# EAGLE design microcontroller_r1 (EAGLE 6.5.0)
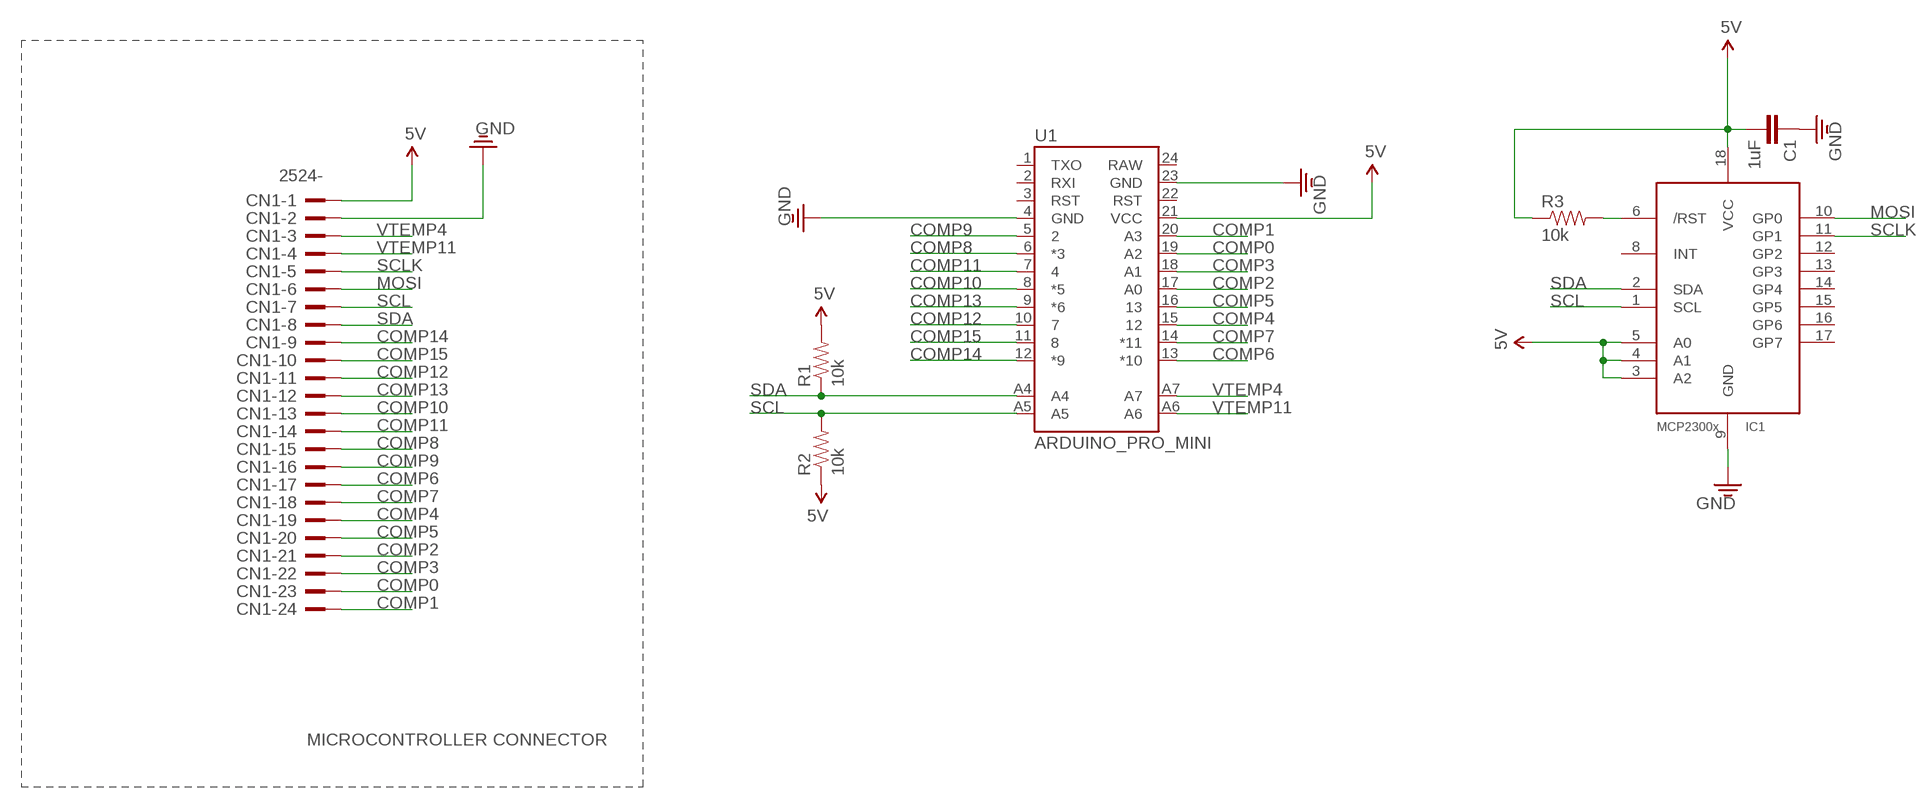
[diagram p0: schematic, sheet 1]

## Parts
C1  1uF  CAP0603  [0603]
CN1  2524-  [PAK100/2500-24]
IC1  MCP2300X/SO  [SO18W]
R1  10k  RESISTOR0603  [0603]
R2  10k  RESISTOR0603  [0603]
R3  10k  RESISTOR0603  [0603]
U1  ARDUINO_PRO_MINI  [ARDUINO_PRO_MINI]

## Nets
5V: C1.2 CN1.1 IC1.3(A2) IC1.4(A1) IC1.5(A0) IC1.18(VCC) R1.2 R2.1 R3.1 U1.21(VCC)
COMP0: CN1.23 U1.19(A2)
COMP1: CN1.24 U1.20(A3)
COMP2: CN1.21 U1.17(A0)
COMP3: CN1.22 U1.18(A1)
COMP4: CN1.19 U1.15
COMP5: CN1.20 U1.16
COMP6: CN1.17 U1.13(*10)
COMP7: CN1.18 U1.14(*11)
COMP8: CN1.15 U1.6(*3)
COMP9: CN1.16 U1.5
COMP10: CN1.13 U1.8(*5)
COMP11: CN1.14 U1.7
COMP12: CN1.11 U1.10
COMP13: CN1.12 U1.9(*6)
COMP14: CN1.9 U1.12(*9)
COMP15: CN1.10 U1.11
GND: C1.1 CN1.2 IC1.9(GND) U1.4(GND) U1.23(GND)
MOSI: CN1.6 IC1.10(GP0)
N$4: IC1.6(/RST) R3.2
SCL: CN1.7 IC1.1(SCL) R2.2 U1.A5
SCLK: CN1.5 IC1.11(GP1)
SDA: CN1.8 IC1.2(SDA) R1.1 U1.A4
VTEMP4: CN1.3 U1.A7
VTEMP11: CN1.4 U1.A6
Unconnected: IC1.8(INT) IC1.12(GP2) IC1.13(GP3) IC1.14(GP4) IC1.15(GP5) IC1.16(GP6) IC1.17(GP7) U1.1(TXO) U1.2(RXI) U1.3(RST) U1.22(RST) U1.24(RAW)

## Notes on the sheet
- MICROCONTROLLER CONNECTOR

## Library data of the parts
C1 = openct:CAP: Capacitor Standard 0603 ceramic capacitor, and 0.1" leaded capacitor.
CN1 = con-3m:2524-: 3M (TM) Pak 100 4-Wall Header Source: 3M; OC_FARNELL: unknown; OC_NEWARK: unknown
IC1 = adafruit:MCP2300X: MCP23008 Inexpensive i2c i/o expander - 8 general purpose i/o pins with optional pullups
R1-R3 = openct:RESISTOR: Resistor Basic schematic elements and footprints for 0603, 1206, and PTH 1/10th watt (small) resistors.
U1 = SparkFun-Boards:ARDUINO_PRO_MINI

## Board
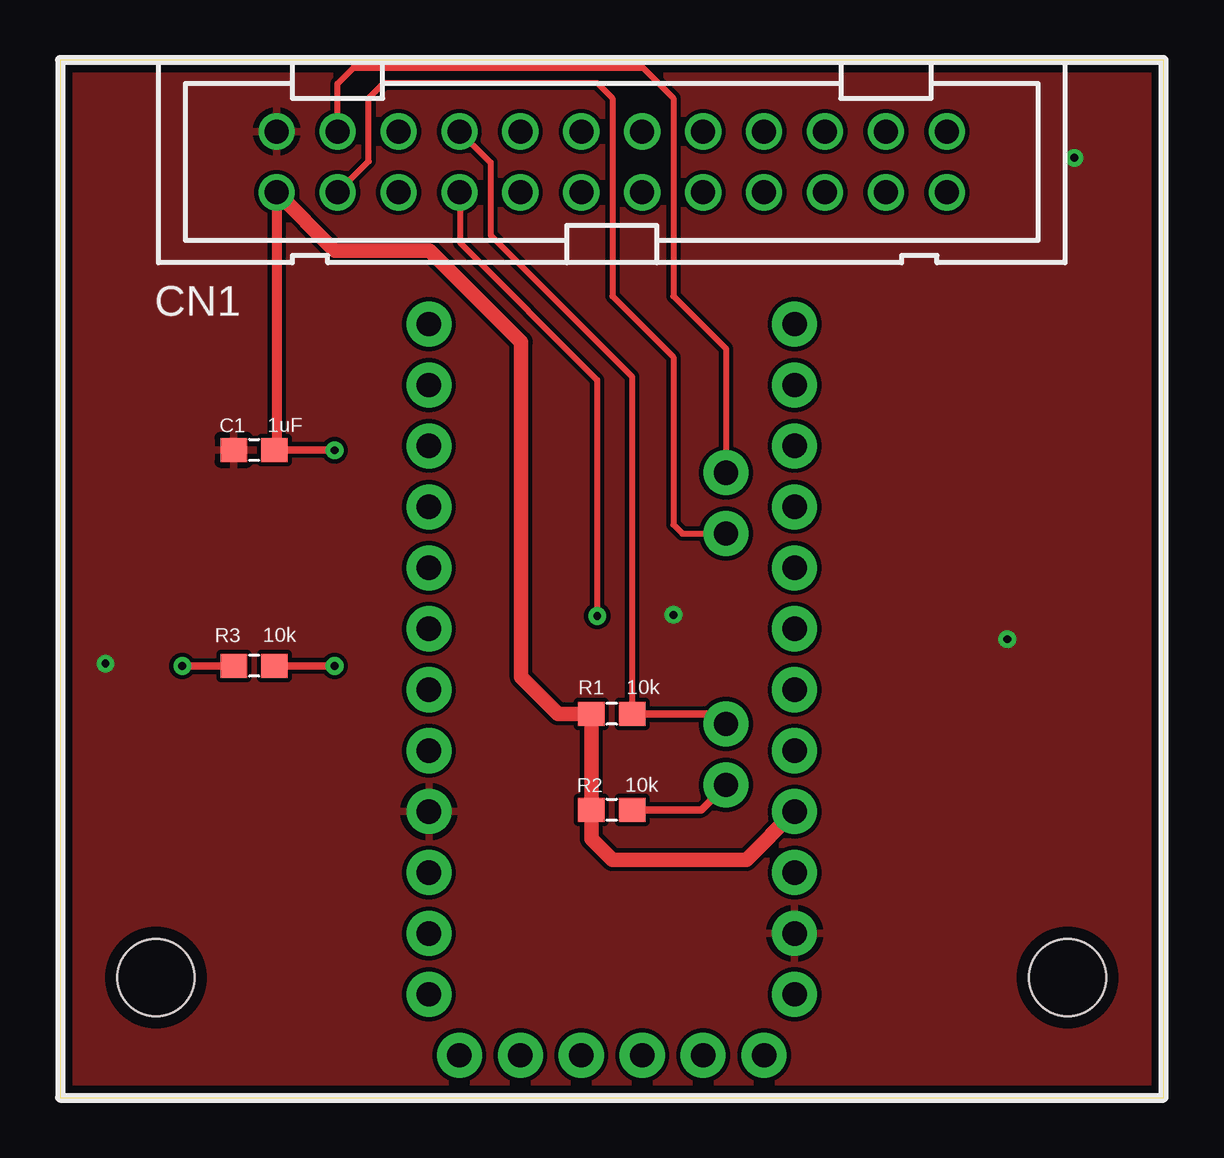
[diagram p1: board, top side]
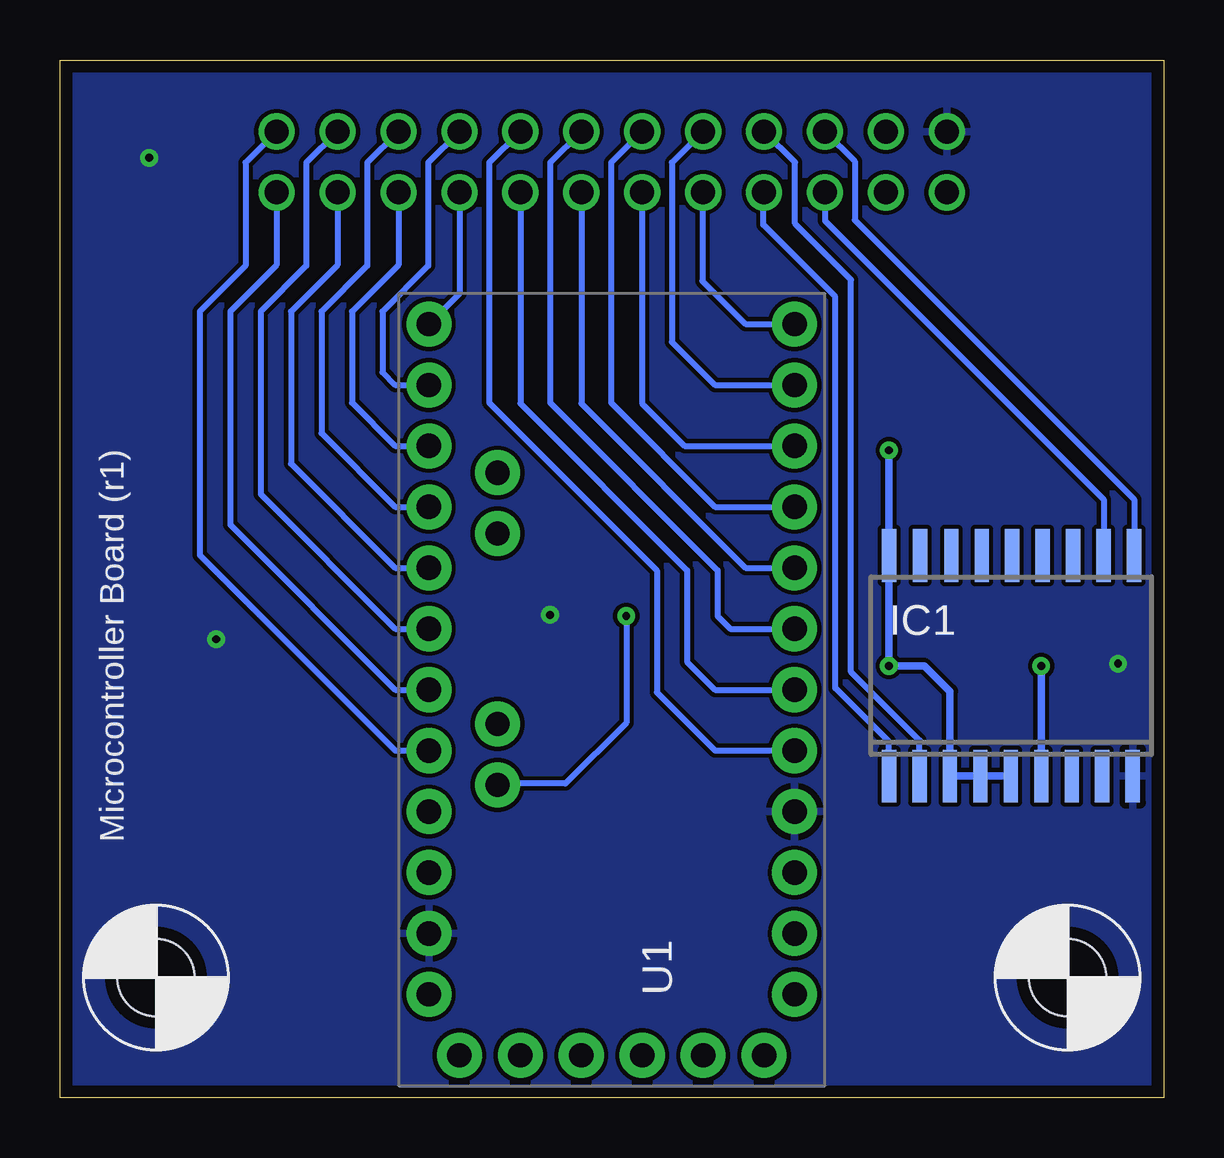
[diagram p2: board, bottom side, seen from below]

Size 46 x 43.25 mm. Coordinates in mm from the lower left corner, seen from the top.
Outline: 0,43.25 0,0 46,0 46,43.25 0,43.25
Copper layers (1*16): Top 0.035mm / dielectric 1.5mm / Bottom 0.035mm
Design rules "default *": minimum track width 10mil, minimum drill 13mil, track to track 7mil, track to pad 8mil, pad to pad 8mil, via to via 8mil, smd to smd 8mil, copper to edge 20mil, drill to drill 8mil, minimum pad ring 10mil, minimum via ring 8mil, stop-mask expansion 4mil, vias tented up to drill 0mil, thermal gap 10mil

### Footprints (pad centres in the part's own frame; a part is rotated, then mirrored left to right if it is on the bottom)
0603 = smd 1.1 x 1: 1 -0.85,0; 2 0.85,0
PAK100/2500-24 = drill 1 pad 1.422: 1 -13.97,-1.27; 2 -13.97,1.27; 3 -11.43,-1.27; 4 -11.43,1.27; 5 -8.89,-1.27; 6 -8.89,1.27; 7 -6.35,-1.27; 8 -6.35,1.27; 9 -3.81,-1.27; 10 -3.81,1.27; 11 -1.27,-1.27; 12 -1.27,1.27; 13 1.27,-1.27; 14 1.27,1.27; 15 3.81,-1.27; 16 3.81,1.27; 17 6.35,-1.27; 18 6.35,1.27; 19 8.89,-1.27; 20 8.89,1.27; 21 11.43,-1.27; 22 11.43,1.27; 23 13.97,-1.27; 24 13.97,1.27
SO18W = smd 0.6 x 2.2: 1 -4.445,-4.6; 2 -3.175,-4.6; 3 -1.905,-4.6; 4 -0.635,-4.6; 5 0.635,-4.6; 6 1.905,-4.6; 7 3.175,-4.6; 8 4.445,-4.6; 9 5.715,-4.6; 10 5.775,4.6; 11 4.505,4.6; 12 3.235,4.6; 13 1.965,4.6; 14 0.695,4.6; 15 -0.575,4.6; 16 -1.845,4.6; 17 -3.145,4.6; 18 -4.445,4.6
ARDUINO_PRO_MINI = drill 1.016 pad 1.88: 1 -7.62,12.7; 2 -7.62,10.16; 3 -7.62,7.62; 4 -7.62,5.08; 5 -7.62,2.54; 6 -7.62,0; 7 -7.62,-2.54; 8 -7.62,-5.08; 9 -7.62,-7.62; 10 -7.62,-10.16; 11 -7.62,-12.7; 12 -7.62,-15.24; 13 7.62,-15.24; 14 7.62,-12.7; 15 7.62,-10.16; 16 7.62,-7.62; 17 7.62,-5.08; 18 7.62,-2.54; 19 7.62,0; 20 7.62,2.54; 21 7.62,5.08; 22 7.62,7.62; 23 7.62,10.16; 24 7.62,12.7; A4 4.763,1.429; A5 4.763,3.969; A6 4.763,-9.049; A7 4.763,-6.509; BLK -6.35,15.24; GND -3.81,15.24; GRN 6.35,15.24; RXI 1.27,15.24; TXO 3.81,15.24; VCC -1.27,15.24
MOUNT-M3 = hole 3.2: 0,0

### Placement (x,y rotation side)
C1  8.09,27 0 top
CN1  23,39 0 top
IC1  7,18 0 bottom
R1  23,16 180 top
R2  23,12 0 top
R3  8.09,18 180 top
U1  23,17 180 bottom
U$35  [MOUNT-M3]  42,5 0 bottom
U$36  [MOUNT-M3]  4,5 0 bottom

### Tracks (layer width: path | path; a pad name or v marks a point on that pad's centre or on a via)
5V  (via drill 0.33)
  Top 0.254: v11.45,17.99 v11.45,18 | v11.45,26.98 11.45,27
  Top 0.305: v11.45,18 R3.1 | 11.45,27 C1.2
  Top 0.406: CN1.1 9.03,27 C1.2
  Top 0.61: U1.21 28.61,9.91 23.03,9.91 22.15,10.79 R2.1 R1.2 20.75,16 19.22,17.53 19.22,31.5 15.41,35.31 11.45,35.31 CN1.1
  Bottom 0.254: v11.44,17.99 v11.45,17.99 | v11.44,26.98 v11.45,26.98
  Bottom 0.305: v11.44,17.99 IC1.18 v11.44,26.98 | IC1.5 IC1.4 IC1.3 8.91,16.93 9.97,18 11.44,18 v11.45,17.99
COMP0
  Bottom 0.254: CN1.23 36.97,34.7 38.91,32.77 38.91,23.88 32.03,17 U1.19
COMP1
  Bottom 0.254: CN1.24 38.27,38.97 38.27,34.67 40.18,32.77 40.18,22.61 32.03,14.46 U1.20
COMP2
  Bottom 0.254: CN1.21 34.43,34.7 36.36,32.77 36.36,26.42 32.03,22.08 U1.17
COMP3
  Bottom 0.254: CN1.22 35.73,38.97 35.73,34.67 37.64,32.77 37.64,25.15 32.03,19.54 U1.18
COMP4
  Bottom 0.254: CN1.19 31.89,34.7 33.83,32.77 33.83,28.96 32.03,27.16 U1.15
COMP5
  Bottom 0.254: CN1.20 33.19,38.97 33.19,34.67 35.09,32.77 35.09,27.69 32.03,24.62 U1.16
COMP6
  Bottom 0.254: CN1.17 29.35,33.51 U1.13
COMP7
  Bottom 0.254: CN1.18 30.65,38.97 30.65,34.67 32.56,32.77 32.56,30.23 32.03,29.7 U1.14
COMP8
  Bottom 0.254: CN1.15 26.81,28.93 19.86,21.98 19.86,18.16 18.69,17 U1.6
COMP9
  Bottom 0.254: CN1.16 28.11,38.97 28.11,28.96 21.12,21.98 21.12,16.9 18.69,14.46 U1.5
COMP10
  Bottom 0.254: CN1.13 24.27,28.93 17.42,22.08 U1.8
COMP11
  Bottom 0.254: CN1.14 25.57,38.97 25.57,28.96 18.58,21.98 18.58,20.07 18.06,19.54 U1.7
COMP12
  Bottom 0.254: CN1.11 21.73,28.93 19.96,27.16 U1.10
COMP13
  Bottom 0.254: CN1.12 23.03,38.97 23.03,28.96 18.69,24.62 U1.9
COMP14
  Bottom 0.254: CN1.9 19.22,37.7 19.22,34.04 17.42,32.24 U1.12
COMP15
  Bottom 0.254: CN1.10 20.49,38.97 20.49,31.5 18.69,29.7 U1.11
GND  (via drill 0.33)
  other vias: 39.49,19.1 25.57,20.12 42.28,39.17 1.9,18.09
  pour Top: 0,43.25 0,0 46,0 46,43.25
  pour Bottom: 0,43.25 0,0 46,0 46,43.25
MOSI
  Bottom 0.254: CN1.6 12.87,39.03 12.87,36.58 1.22,24.94 IC1.10
N$4  (via drill 0.33)
  Top 0.305: v5.1,17.99 7.23,17.99 R3.2
  Bottom 0.305: IC1.6 v5.09,17.98 v5.1,17.99
SCL  (via drill 0.33)
  Top 0.254: CN1.7 16.68,37.7 16.68,35.63 22.39,29.91 v22.39,20.07
  Top 0.305: R2.2 26.73,12 U1.A5
  Bottom 0.254: v22.39,20.07 22.39,15.62 24.94,13.09 27.71,13.09 U1.A5 | IC1.1 11.44,14.84 13.68,17.07 13.68,33.38 16.68,36.38 16.68,37.7 CN1.7
SCLK
  Bottom 0.254: CN1.5 14.11,36.55 2.5,24.94 IC1.11
SDA
  Top 0.254: CN1.8 17.95,38.97 17.95,35.94 23.85,30.05 R1.1
  Top 0.305: R1.1 27.33,16 U1.A4
  Bottom 0.254: IC1.2 10.17,14.89 13.02,17.73 13.02,34.09 15.36,36.43 15.36,38.98 CN1.8
VTEMP4
  Top 0.254: CN1.3 12.87,39.03 12.87,41.66 13.5,42.3 22.39,42.3 23.03,41.66 23.03,33.41 25.57,30.87 25.57,23.88 25.94,23.51 U1.A7
VTEMP11
  Top 0.254: CN1.4 11.57,42.27 12.23,42.93 24.3,42.93 25.57,41.66 25.57,33.41 27.76,31.21 U1.A6

### Text on the board
bPlace: Microcontroller Board (r1)